# Altium schematic sheet 1-TX510_KIT.SchDoc: HD-S16-MB-V1.0
size A4
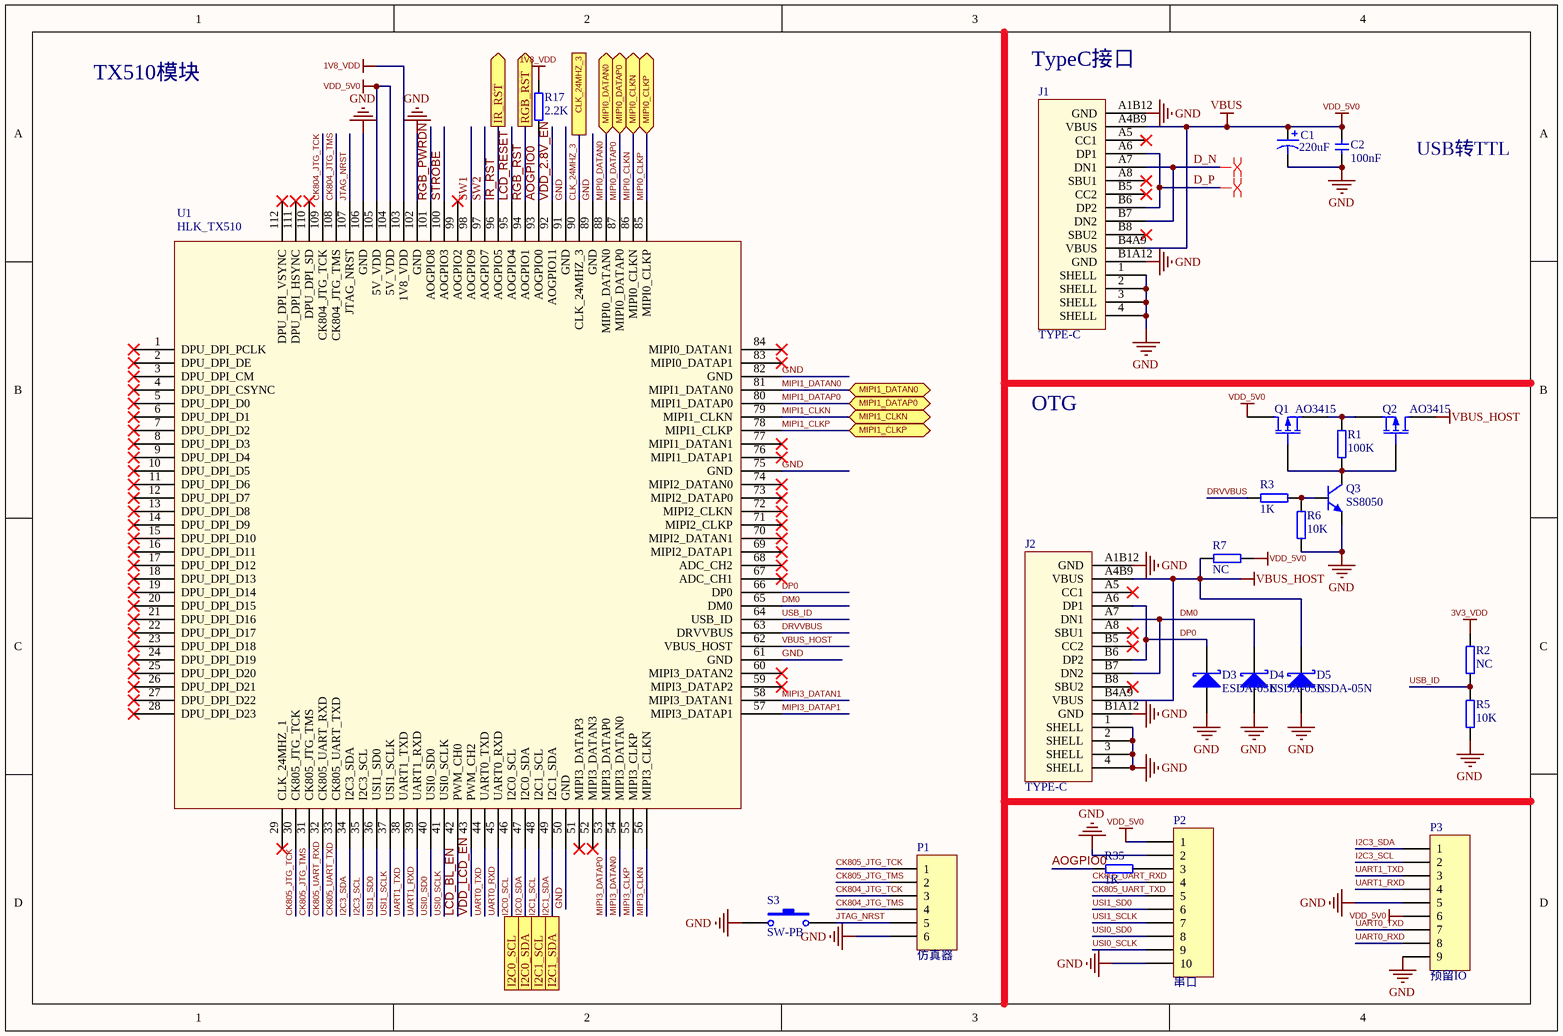
[diagram p0: 1-TX510_KIT.SchDoc]

## Parts
C1  value 220uF  [SMD,6.3x7.7mm]  (hidden comment: Cap Pol1)
C2  100nF  [C0402]
D3  ESDA-05N  [R0402]
D4  ESDA-05N  [R0402]
D5  ESDA-05N  [R0402]
J1  TYPE-C  [TYPE-C16PIN]
J2  TYPE-C  [TYPE-C16PIN]
P1  仿真器  [HDR1X6]
P2  串口  [HDR1X10]
P3  预留IO  [HDR1X9]
Q1  AO3415  [SOT-23]
Q2  AO3415  [SOT-23]
Q3  SS8050  [SOT23-BEC]
R1  100K  [R0402]
R2  NC  [R0402]
R3  1K  [R0402]
R5  10K  [R0402]
R6  10K  [R0402]
R7  NC  [RES_0603]
R17  2.2K  [R0402]
R35  1K  [R0402]
S3  SW-PB  [轻触开关4.5x4.5]
U1  HLK_TX510  [HLK_TX510 _KIT]

## Ports
CLK_24MHZ_3, I2C0_SCL, I2C0_SDA, I2C1_SCL, I2C1_SDA, IR_RST (out), MIPI0_CLKN (bidir), MIPI0_CLKP (bidir), MIPI0_DATAN0 (bidir), MIPI0_DATAP0 (bidir), MIPI1_CLKN (bidir), MIPI1_CLKP (bidir), MIPI1_DATAN0 (bidir), MIPI1_DATAP0 (bidir), RGB_RST (out)

## Nets
1V8_VDD: R17.2 U1.103(1V8_VDD)
3V3_VDD: R2.2
GND: C1.2 C2.1 D3.1(A) D4.1(A) D5.1(A) J1.1(SHELL) J1.2(SHELL) J1.3(SHELL) J1.4(SHELL) J1.A1B12(GND) J1.B1A12(GND) J2.1(SHELL) J2.2(SHELL) J2.3(SHELL) J2.4(SHELL) J2.A1B12(GND) J2.B1A12(GND) P1.6 P2.2 P2.10 P3.5 P3.9 Q3.E R5.1 R6.1 S3.1 U1.50(GND) U1.61(GND) U1.75(GND) U1.82(GND) U1.89(GND) U1.91(GND) U1.102(GND) U1.106(GND)
VBUS: C1.1 C2.2 J1.A4B9(VBUS) J1.B4A9(VBUS) P2.1 P3.6 Q1.3(D) R7.1 U1.104(5V_VDD) U1.105(5V_VDD)  [also labelled VDD_5V0]
VBUS_HOST: D5.2(K) J2.A4B9(VBUS) J2.B4A9(VBUS) Q2.3(D) R7.2 U1.62(VBUS_HOST)
AOGPIO0: R17.1 R35.2 U1.93(AOGPIO0)
CK804_JTG_TCK: P1.3 U1.109(CK804_JTG_TCK)
CK804_JTG_TMS: P1.4 U1.108(CK804_JTG_TMS)
CK805_JTG_TCK: P1.1 U1.30(CK805_JTG_TCK)
CK805_JTG_TMS: P1.2 U1.31(CK805_JTG_TMS)
CK805_UART_RXD: P2.4 U1.32(CK805_UART_RXD)
CK805_UART_TXD: P2.5 U1.33(CK805_UART_TXD)
CLK_24MHZ_3: U1.90(CLK_24MHZ_3) ; port CLK_24MHZ_3
D_N: J1.A7(DN1) J1.B7(DN2)
D_P: J1.A6(DP1) J1.B6(DP2)
DM0: D4.2(K) J2.A7(DN1) J2.B7(DN2) U1.65(DM0)
DP0: D3.2(K) J2.A6(DP1) J2.B6(DP2) U1.66(DP0)
DRVVBUS: R3.2 U1.63(DRVVBUS)
I2C0_SCL: U1.46(I2C0_SCL) ; port I2C0_SCL
I2C0_SDA: U1.47(I2C0_SDA) ; port I2C0_SDA
I2C1_SCL: U1.48(I2C1_SCL) ; port I2C1_SCL
I2C1_SDA: U1.49(I2C1_SDA) ; port I2C1_SDA
I2C3_SCL: P3.2 U1.35(I2C3_SCL)
I2C3_SDA: P3.1 U1.34(I2C3_SDA)
IR_RST: U1.96(AOGPIO5) ; port IR_RST
JTAG_NRST: P1.5 S3.2 U1.107(JTAG_NRST)
LCD_BL_EN: U1.42(PWM_CH0)
LCD_RESET: U1.95(AOGPIO4)
MIPI0_CLKN: U1.86(MIPI0_CLKN) ; port MIPI0_CLKN
MIPI0_CLKP: U1.85(MIPI0_CLKP) ; port MIPI0_CLKP
MIPI0_DATAN0: U1.88(MIPI0_DATAN0) ; port MIPI0_DATAN0
MIPI0_DATAP0: U1.87(MIPI0_DATAP0) ; port MIPI0_DATAP0
MIPI1_CLKN: U1.79(MIPI1_CLKN) ; port MIPI1_CLKN
MIPI1_CLKP: U1.78(MIPI1_CLKP) ; port MIPI1_CLKP
MIPI1_DATAN0: U1.81(MIPI1_DATAN0) ; port MIPI1_DATAN0
MIPI1_DATAP0: U1.80(MIPI1_DATAP0) ; port MIPI1_DATAP0
MIPI3_CLKN: U1.56(MIPI3_CLKN)
MIPI3_CLKP: U1.55(MIPI3_CLKP)
MIPI3_DATAN0: U1.54(MIPI3_DATAN0)
MIPI3_DATAN1: U1.58(MIPI3_DATAN1)
MIPI3_DATAP0: U1.53(MIPI3_DATAP0)
MIPI3_DATAP1: U1.57(MIPI3_DATAP1)
RGB_PWRDN: U1.101(AOGPIO8)
RGB_RST: U1.94(AOGPIO1) ; port RGB_RST
STROBE: U1.100(AOGPIO3)
SW1: U1.98(AOGPIO9)
SW2: U1.97(AOGPIO7)
UART0_RXD: P3.8 U1.45(UART0_RXD)
UART0_TXD: P3.7 U1.44(UART0_TXD)
UART1_RXD: P3.4 U1.39(UART1_RXD)
UART1_TXD: P3.3 U1.38(UART1_TXD)
USB_ID: R2.1 R5.2 U1.64(USB_ID)
USI0_SCLK: P2.9 U1.41(USI0_SCLK)
USI0_SD0: P2.8 U1.40(USI0_SD0)
USI1_SCLK: P2.7 U1.37(USI1_SCLK)
USI1_SD0: P2.6 U1.36(USI1_SD0)
VDD_2.8V_EN: U1.92(AOGPIO11)
VDD_LCD_EN: U1.43(PWM_CH2)
NetP2_3: P2.3 R35.1
NetQ1_1: Q1.1(G) Q2.1(G) Q3.C R1.1
NetQ1_2: Q1.2(S) Q2.2(S) R1.2
NetQ3_B: Q3.B R3.1 R6.2

Not connected (* = marked no-connect by the designer): J1 A5(CC1)* A8(SBU1)* B5(CC2)* B8(SBU2)*; J2 A5(CC1)* A8(SBU1)* B5(CC2)* B8(SBU2)*; U1 1(DPU_DPI_PCLK)* 2(DPU_DPI_DE)* 3(DPU_DPI_CM)* 4(DPU_DPI_CSYNC)* 5(DPU_DPI_D0)* 6(DPU_DPI_D1)* 7(DPU_DPI_D2)* 8(DPU_DPI_D3)* 9(DPU_DPI_D4)* 10(DPU_DPI_D5)* 11(DPU_DPI_D6)* 12(DPU_DPI_D7)* 13(DPU_DPI_D8)* 14(DPU_DPI_D9)* 15(DPU_DPI_D10)* 16(DPU_DPI_D11)* 17(DPU_DPI_D12)* 18(DPU_DPI_D13)* 19(DPU_DPI_D14)* 20(DPU_DPI_D15)* 21(DPU_DPI_D16)* 22(DPU_DPI_D17)* 23(DPU_DPI_D18)* 24(DPU_DPI_D19)* 25(DPU_DPI_D20)* 26(DPU_DPI_D21)* 27(DPU_DPI_D22)* 28(DPU_DPI_D23)* 29(CLK_24MHZ_1)* 51(MIPI3_DATAP3)* 52(MIPI3_DATAN3)* 59(MIPI3_DATAP2)* 60(MIPI3_DATAN2)* 67(ADC_CH1)* 68(ADC_CH2)* 69(MIPI2_DATAP1)* 70(MIPI2_DATAN1)* 71(MIPI2_CLKP)* 72(MIPI2_CLKN)* 73(MIPI2_DATAP0)* 74(MIPI2_DATAN0)* 76(MIPI1_DATAP1)* 77(MIPI1_DATAN1)* 83(MIPI0_DATAP1)* 84(MIPI0_DATAN1)* 99(AOGPIO2)* 110(DPU_DPI_SD)* 111(DPU_DPI_HSYNC)* 112(DPU_DPI_VSYNC)*

## Layout directives
differential pair: D_N, D_P

## Notes on the sheet
- TX510模块
- (near J1) TypeC接口
- USB转TTL
- OTG

## Library data of the parts
C1 = Cap Pol1: Polarized Capacitor (Radial); Published: 8-Jun-2000; LatestRevisionDate: 17-Jul-2002; LatestRevisionNote: Re-released for DXP Platform.; PackageReference: RB7.6-15; Publisher: Altium Limited
C2 = CAP1: C?
D3-D5 = Diode BAS70: Silicon AF Schottky Diode for High-Speed Switching; Note: Pin 2 is not connected and not drawn.; Published: 21-Mar-2003; DatasheetDocument: Oct-1999; PackageDocument: Sep-2001; PackageReference: SOT-23; Publisher: Altium Limited; ComponentLink1Description: Manufacturer Link; ComponentLink1URL: http://www.infineon.com/; ComponentLink2Description: Datasheet; ComponentLink2URL: http://www.infineon.com/upload/Document/cmc_upload/documents/009/382/bas40_bas140series_1.pdf
J1 J2 = TYPE-C16PIN
P1 = Header 6: Header, 6-Pin; LatestRevisionDate: 17-Jul-2002; LatestRevisionNote: Re-released for DXP Platform.; Publisher: Altium Limited
P2 = Header 10: Header, 10-Pin; LatestRevisionDate: 17-Jul-2002; LatestRevisionNote: Re-released for DXP Platform.; Publisher: Altium Limited
P3 = Header 9: Header, 9-Pin; LatestRevisionDate: 17-Jul-2002; LatestRevisionNote: Re-released for DXP Platform.; Publisher: Altium Limited
Q3 = NPN: 贴片三极管
R1-R3 R5-R7 R17 R35 = RES1: R?
S3 = SW-PB: Switch; Published: 24-Mar-1999; LatestRevisionDate: 17-Jul-2002; LatestRevisionNote: Re-released for DXP Platform.; PackageReference: SPST-2; Publisher: Altium Limited; PackageDescription: Switch; 2 Leads